# EAGLE design ld_sampling_head (EAGLE 9.2.2)
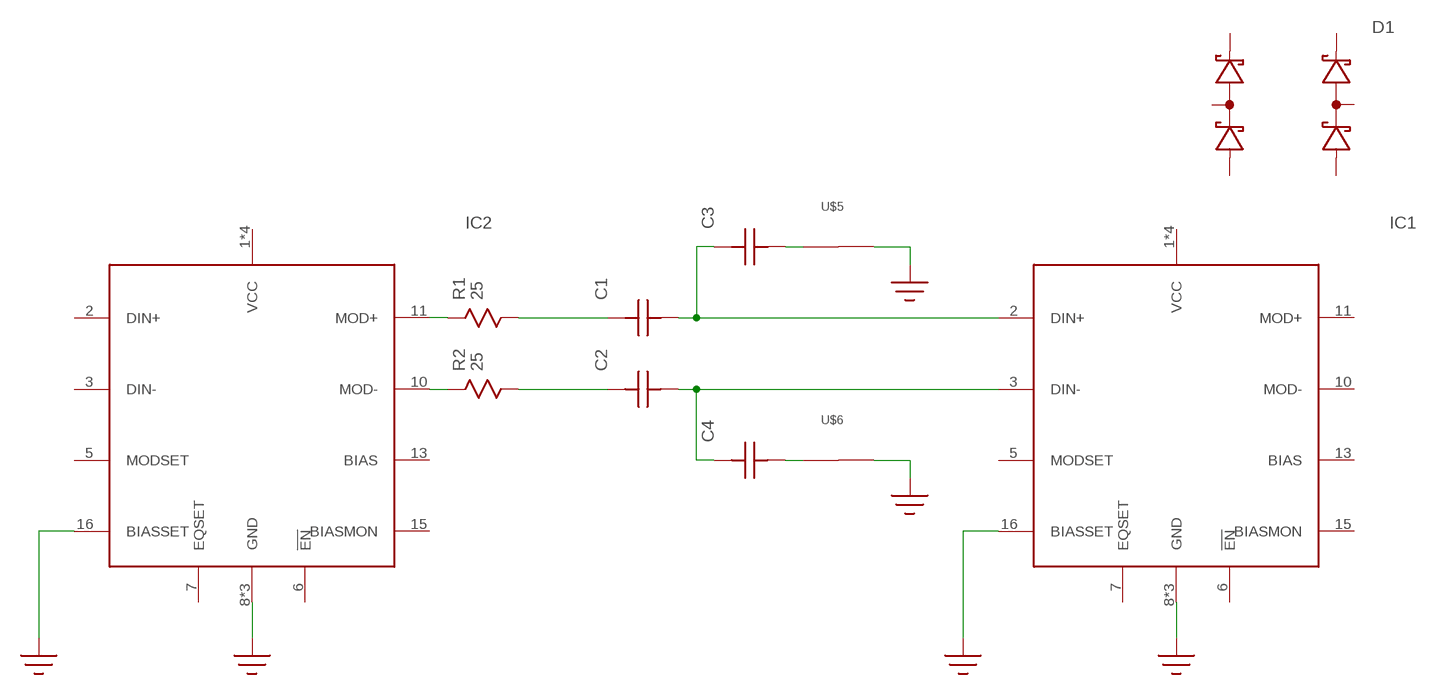
[diagram p0: schematic, sheet 1]

## Parts
C1  C  [C0402]
C2  C  [C0402]
C3  C  [C0402]
C4  C  [C0402]
D1  SMS3923-081  [SC-88]
IC1  SY88022AL  [TQFN16-EP]
IC2  SY88022AL  [TQFN16-EP]
R1  25  R0402  [0402]
R2  25  R0402  [0402]
U$5  SHORT14MIL  [SHORT_14MIL]
U$6  SHORT14MIL  [SHORT_14MIL]

## Nets
GND: IC1.8(GND) IC1.14(GND) IC1.16(BIASSET) IC1.EP(GND) IC2.8(GND) IC2.14(GND) IC2.16(BIASSET) IC2.EP(GND) U$5.P$2 U$6.P$2
N$1: IC2.11(MOD+) R1.1
N$2: IC2.10(MOD-) R2.1
N$3: C1.1 C3.2 IC1.2(DIN+)
N$4: C2.1 C4.2 IC1.3(DIN-)
N$5: C1.2 R1.2
N$6: C2.2 R2.2
N$9: C3.1 U$5.P$1
N$10: C4.1 U$6.P$1
Unconnected: D1.1(ANODE0) D1.2(COMMON0) D1.3(CATHODE0) D1.4(CATHODE1) D1.5(COMMON1) D1.6(ANODE1) IC1.1(VCC) IC1.4(VCC) IC1.5(MODSET) IC1.6(!EN!) IC1.7(EQSET) IC1.9(VCC) IC1.10(MOD-) IC1.11(MOD+) IC1.12(VCC) IC1.13(BIAS) IC1.15(BIASMON) IC2.1(VCC) IC2.2(DIN+) IC2.3(DIN-) IC2.4(VCC) IC2.5(MODSET) IC2.6(!EN!) IC2.7(EQSET) IC2.9(VCC) IC2.12(VCC) IC2.13(BIAS) IC2.15(BIASMON)

## Library data of the parts
C1-C4 = yapo:C
D1 = yapo:SMS3923-081
IC1 IC2 = yapo:SY88022AL
R1 R2 = yapo:R
U$5 U$6 = yapo:SHORT

## Board
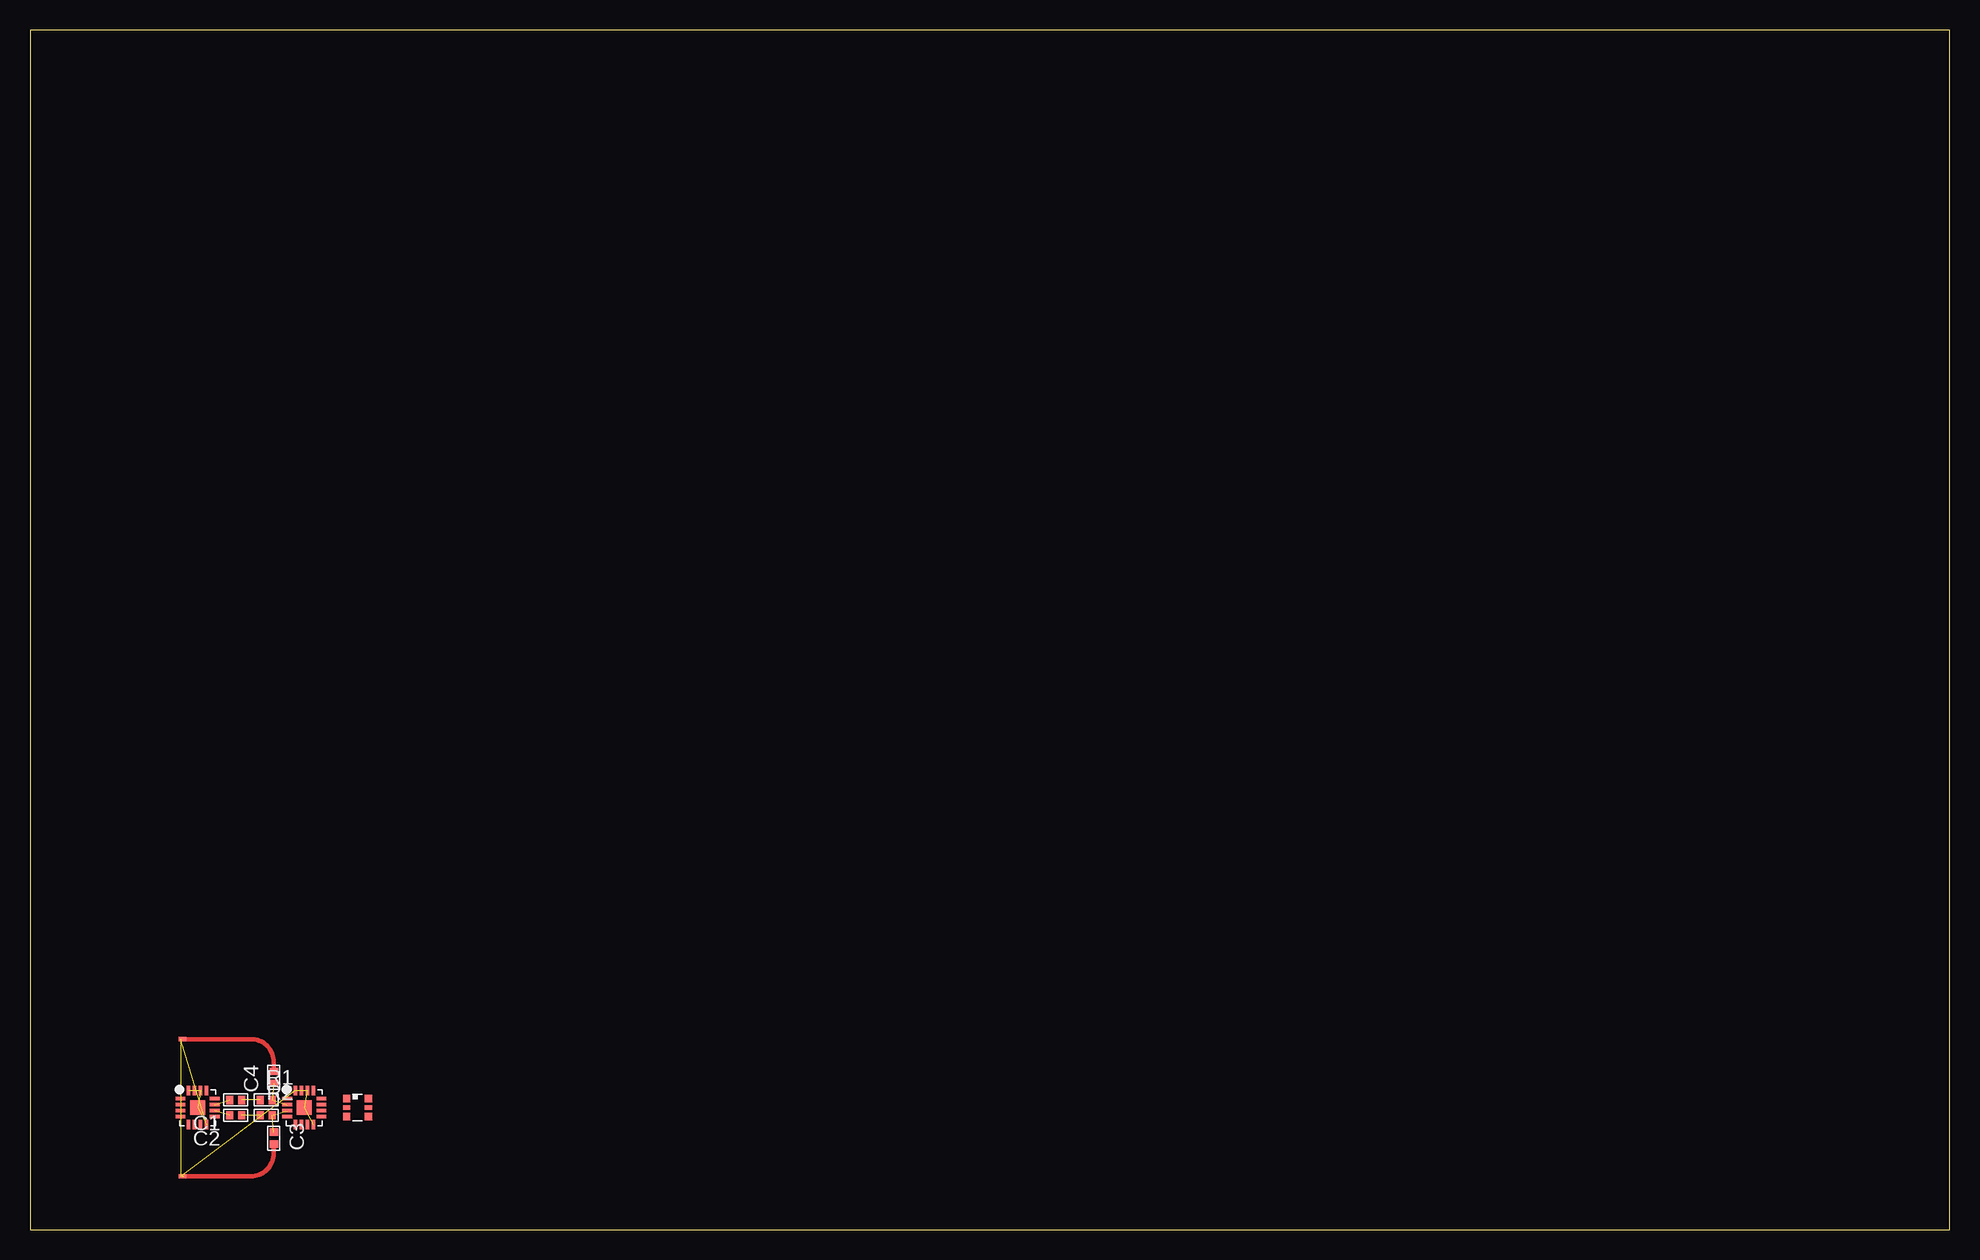
[diagram p1: board, top side]

Size 160 x 100 mm. Coordinates in mm from the lower left corner, seen from the top.
Outline: 0,0 160,0 160,100 0,100 0,0
Copper layers (1*16): Top 0.035mm / dielectric 1.5mm / Bottom 0.035mm
Design rules "default": minimum track width 6mil, minimum drill 0.35mm, track to track 6mil, track to pad 6mil, pad to pad 6mil, via to via 6mil, smd to smd 6mil, copper to edge 40mil, drill to drill 6mil, minimum pad ring 10mil, minimum via ring 8mil, stop-mask expansion 4mil, vias tented up to drill 0mil, thermal gap 10mil

### Footprints (pad centres in the part's own frame; a part is rotated, then mirrored left to right if it is on the bottom)
C0402 = smd 0.6 x 0.7: 1 -0.5,0; 2 0.5,0
SC-88 = smd 0.6 x 0.6: 1 -0.9,0.75; 3 -0.9,-0.75; 4 0.9,-0.75; 6 0.9,0.75 | smd 0.6 x 0.4: 2 -0.9,0; 5 0.9,0
TQFN16-EP = smd 0.3 x 0.8: 1 -0.75,-1.425; 2 -0.25,-1.425; 3 0.25,-1.425; 4 0.75,-1.425; 9 0.75,1.425; 10 0.25,1.425; 11 -0.25,1.425; 12 -0.75,1.425 | smd 0.8 x 0.3: 5 1.425,-0.75; 6 1.425,-0.25; 7 1.425,0.25; 8 1.425,0.75; 13 -1.425,0.75; 14 -1.425,0.25; 15 -1.425,-0.25; 16 -1.425,-0.75 | smd 1.23 x 1.23: EP 0,0
0402 = smd 0.6 x 0.7: 1 -0.5,0; 2 0.5,0
SHORT_14MIL = smd 0.356 x 0.356: P$1 -0.127,0; P$2 0.127,0

### Placement (x,y rotation side)
C1  19.68,10.79 180 top
C2  19.68,9.53 180 top
C3  20.32,12.7 270 top
C4  20.32,7.62 90 top
D1  27.3,10.16 0 top
IC1  22.86,10.16 270 top
IC2  13.97,10.16 270 top
R1  17.14,10.79 0 top
R2  17.14,9.53 0 top
U$5  12.7,15.88 180 top
U$6  12.7,4.45 180 top

### Tracks (layer width: path | path; a pad name or v marks a point on that pad's centre or on a via)
GND  (9 unrouted)
N$1  (1 unrouted)
N$2  (1 unrouted)
N$3  (2 unrouted)
N$4  (2 unrouted)
N$5  (1 unrouted)
N$6  (1 unrouted)
N$9
  Top 0.356: C3.1 20.32,13.97 arc90 18.41,15.88 U$5.P$1
N$10  (1 unrouted)
  Top 0.356: C4.1 20.32,6.35 arc-90 18.41,4.45 12.7,4.45